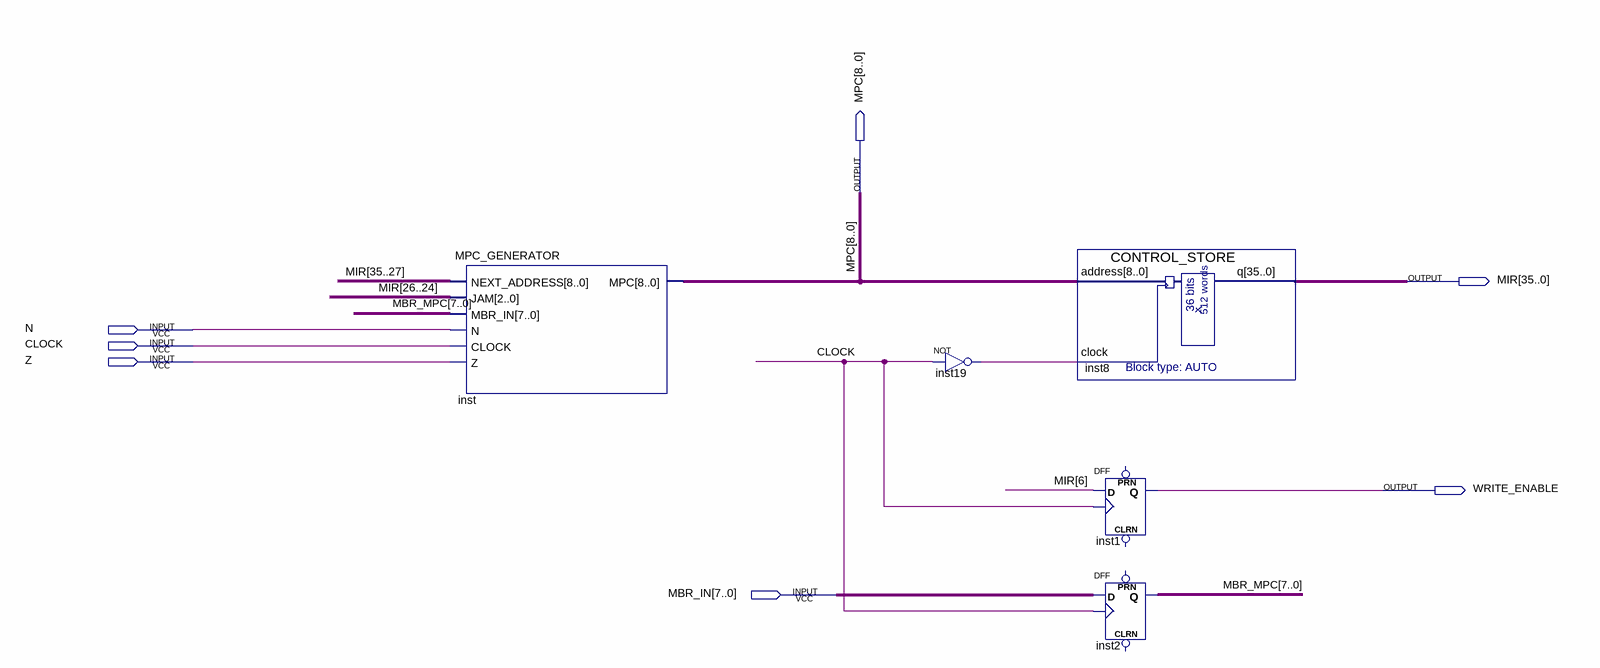
[diagram p0: schematic sheet]
// Quartus schematic CONTROL_UNIT.bdf as structural Verilog: 5 symbols, 7 pins
module CONTROL_UNIT (
  input  N,
  input  CLOCK,
  input  Z,
  input  [7:0] MBR_IN,
  output [8:0] MPC,
  output [35:0] MIR,
  output WRITE_ENABLE
);

  wire inst19_out;
  wire [7:0] MBR_MPC;

  MPC_GENERATOR inst (
    .NEXT_ADDRESS(MIR[35:27]), .JAM(MIR[26:24]), .MBR_IN(MBR_MPC), .N(N), .CLOCK(CLOCK), .Z(Z), .MPC(MPC));
  not inst19 (inst19_out, CLOCK);
  CONTROL_STORE inst8 (.address(MPC), .clock(inst19_out), .q(MIR));
  DFF inst1 (.CLK(CLOCK), .D(MIR[6]), .Q(WRITE_ENABLE));  // open: CLRN, PRN
  DFF inst2[7:0] (.CLK(CLOCK), .D(MBR_IN), .Q(MBR_MPC));  // open: CLRN, PRN
endmodule
